# EAGLE design dc_dc_2 (EAGLE 9.6.2)
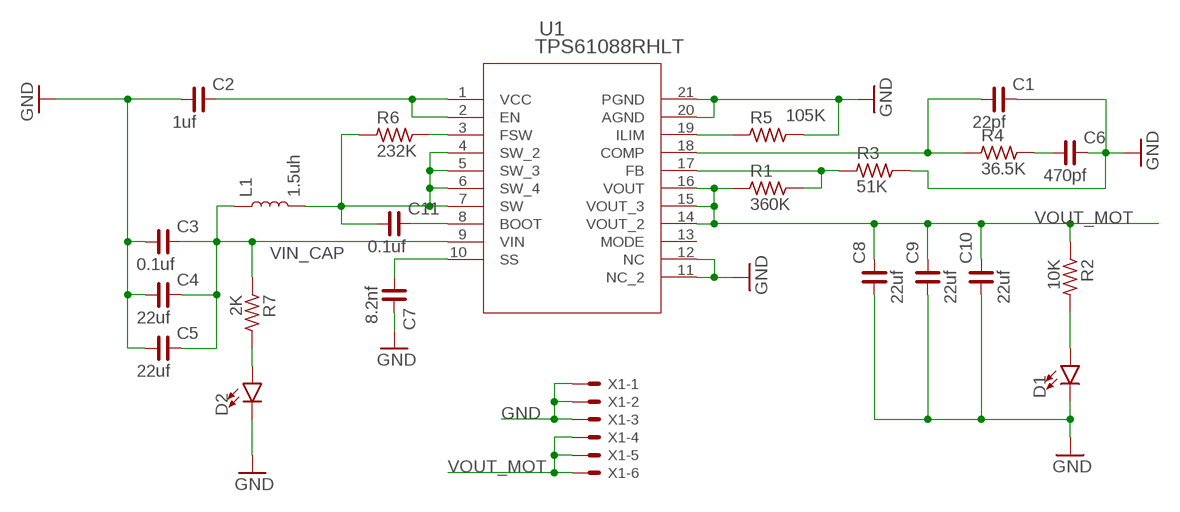
[diagram p0: schematic, sheet 1]

## Parts
C1  22pf  C_0603  [C0603]
C2  1uf  C_0603  [C0603]
C3  0.1uf  C_1210  [C1210]
C4  22uf  C_1210  [C1210]
C5  22uf  C_1210  [C1210]
C6  470pf  C_0603  [C0603]
C7  8.2nf  C_0603  [C0603]
C8  22uf  C_1210  [C1210]
C9  22uf  C_1210  [C1210]
C10  22uf  C_1210  [C1210]
C11  0.1uf  C_0603  [C0603]
D1  LED0603  [LED-0603]
D2  LED0603  [LED-0603]
L1  1.5uh  INDUCTOR-CR75-68UH  [CR75]
R1  360K  R_0603  [R0603]
R2  10K  R_0603  [R0603]
R3  51K  R_0603  [R0603]
R4  36.5K  R_0603  [R0603]
R5  105K  R_0603  [R0603]
R6  232K  R_0603  [R0603]
R7  2K  R_0603  [R0603]
U1  TPS61088RHLT  [RHL0020A_TEX]
X1  22-23-2061  [22-23-2061]

## Nets
GND: C1.2 C2.1 C3.1 C4.1 C5.1 C6.2 C7.2 C8.1 C9.1 C10.1 D1.C D2.C R3.2 R5.2 U1.11(NC_2) U1.12(NC) U1.20(AGND) U1.21(PGND) X1.1 X1.2 X1.3
N$1: C7.1 U1.10(SS)
N$2: R5.1 U1.19(ILIM)
N$3: C1.1 R4.1 U1.18(COMP)
N$4: C6.1 R4.2
N$5: C2.2 U1.1(VCC) U1.2(EN)
N$6: D2.A R7.2
N$8: R1.2 R3.1 U1.17(FB)
N$9: D1.A R2.2
N$10: C11.2 U1.8(BOOT)
N$11: C11.1 L1.P$2 R6.1 U1.4(SW_2) U1.5(SW_3) U1.6(SW_4) U1.7(SW)
N$12: R6.2 U1.3(FSW)
VIN_CAP: C3.2 C4.2 C5.2 L1.P$1 R7.1 U1.9(VIN)
VOUT_MOT: C8.2 C9.2 C10.2 R1.1 R2.1 U1.14(VOUT_2) U1.15(VOUT_3) U1.16(VOUT) X1.4 X1.5 X1.6
Unconnected: U1.13(MODE)

## Library data of the parts
C1-C11 = rc-master-smd:C_: NON-POLARIZED CAP
D1 D2 = SparkFun-LED:LED: LED (Generic) Standard schematic elements and footprints for 5mm, 3mm, 1206, and 0603 sized LEDs. Generic LEDs with no color specified.
L1 = SparkFun-Coils:INDUCTOR: Inductors Resist changes in electrical current. Basically a coil of wire. SparkFun Products: SparkFun Load Cell Amplifier - HX711 <https://www.sparkfun.com/products/13879> IOIO-OTG - V2.2 <https://www.sparkfun.com/products/13613>; PROD_ID: NDUC-09739; VALUE: 68µH/±20%/1.05A
R1-R7 = rc-master-smd:R_: RESISTOR
U1 = TPS61088:TPS61088RHLT: TPS61088; BUILT_BY: EMA_UL_Team; COPYRIGHT: Copyright (C) 2018 Accelerated Designs. All rights reserved; MANUFACTURER_PART_NUMBER: TPS61088RHLT; SOURCELIBRARY: TI_2019-03-28; VENDOR: Texas Instruments
X1 = con-molex:22-23-2061: .100" (2.54mm) Center Header - 6 Pin; MF: MOLEX; MPN: 22-23-2061; OC_FARNELL: 1462922; OC_NEWARK: 27C1933

## Board
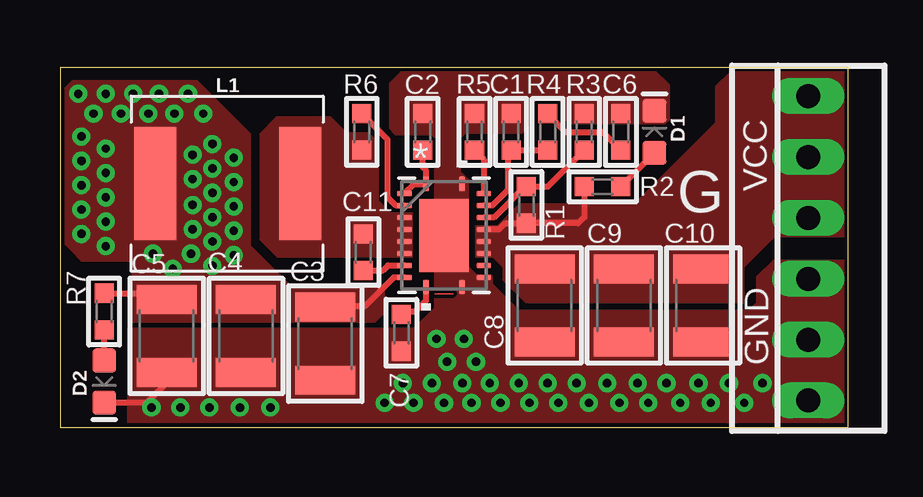
[diagram p1: board, top side]
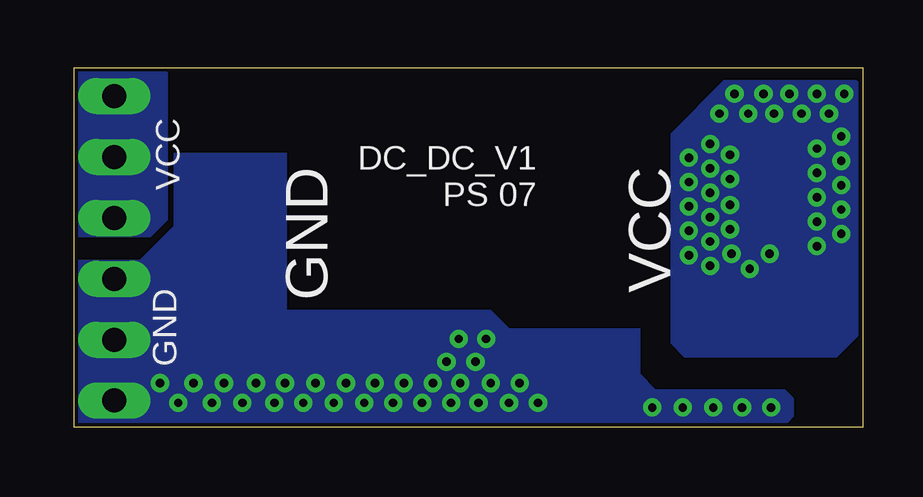
[diagram p2: board, bottom side, seen from below]

Size 32.84 x 15 mm. Coordinates in mm from the lower left corner, seen from the top.
Outline: 0,0 32.84,0 32.84,15 0,15 0,0
Copper layers (1*16): Top 0.035mm / dielectric 1.5mm / Bottom 0.035mm
Design rules "default *": minimum track width 6mil, minimum drill 0.35mm, track to track 6mil, track to pad 6mil, pad to pad 6mil, via to via 6mil, smd to smd 6mil, copper to edge 6mil, drill to drill 6mil, minimum pad ring 10mil, minimum via ring 8mil, stop-mask expansion 4mil, vias tented up to drill 30mil, thermal gap 10mil

### Footprints (pad centres in the part's own frame; a part is rotated, then mirrored left to right if it is on the bottom)
C0603 = smd 0.8 x 0.8: 1 -0.762,0; 2 0.762,0
C1210 = smd 1.2 x 2.5: 1 -1.524,0; 2 1.524,0
LED-0603 = smd 1 x 1: A -0.877,0; C 0.877,0
CR75 = smd 1.75 x 4.7: P$1 -3.025,0; P$2 3.025,0
R0603 = smd 0.8 x 0.8: 1 -0.762,0; 2 0.762,0
RHL0020A_TEX = smd 0.229 x 0.61: 1 -0.75,2.15; 10 -0.75,-2.15; 11 0.75,-2.15; 20 0.75,2.15 | smd 0.61 x 0.229: 2 -1.65,1.75; 3 -1.65,1.25; 4 -1.65,0.75; 5 -1.65,0.25; 6 -1.65,-0.25; 7 -1.65,-0.75; 8 -1.65,-1.25; 9 -1.65,-1.75; 12 1.65,-1.75; 13 1.65,-1.25; 14 1.65,-0.75; 15 1.65,-0.25; 16 1.65,0.25; 17 1.65,0.75; 18 1.65,1.25; 19 1.65,1.75 | smd 2.057 x 3.048: 21 0,0
22-23-2061 = drill 1 long: 1 -6.35,0; 2 -3.81,0; 3 -1.27,0; 4 1.27,0; 5 3.81,0; 6 6.35,0

### Placement (x,y rotation side)
C1  18.8,12.32 90 top
C2  15.11,12.32 270 top
C3  11.05,3.49 90 top
C4  7.75,3.81 90 top
C5  4.45,3.81 90 top
C6  23.37,12.32 90 top
C7  14.22,3.94 270 top
C8  20.19,5.08 90 top
C9  23.5,5.08 90 top
C10  26.8,5.08 90 top
C11  12.64,7.3 270 top
D1  24.77,12.32 90 top
D2  1.84,1.91 270 top
L1  6.99,10.16 0 top
R1  19.43,9.27 90 top
R2  22.61,10.03 0 top
R3  21.84,12.32 90 top
R4  20.32,12.32 90 top
R5  17.27,12.32 90 top
R6  12.57,12.32 90 top
R7  1.84,4.83 270 top
U1  16,8 0 top
X1  31.18,7.46 90 top

### Tracks (layer width: path | path; a pad name or v marks a point on that pad's centre or on a via)
GND  (via drill 0.35)
  Top 0.254: D2.C 3.63,1.03 4.45,1.84 C5.1
  other vias: 3.81,0.83 5.02,0.83 6.22,0.83 7.49,0.83 8.76,0.83 13.53,1.02 14.73,1.02 16,1.02 17.14,1.02 18.35,1.02 19.56,1.02 20.76,1.02 22.03,1.02 23.3,1.02 24.51,1.02 25.84,1.02 27.11,1.02 28.51,1.02 14.29,1.84 15.49,1.84 16.76,1.84 17.91,1.84 19.11,1.84 20.32,1.84 21.53,1.84 22.8,1.84 24.07,1.84 25.27,1.84 26.61,1.84 27.88,1.84 29.27,1.84 16.13,2.73 17.34,2.73 16.83,3.68 15.68,3.68
  pour Top (no thermals): 17.02,9.53 17.02,6.73 17.37,6.38 17.97,6.38 18.03,6.32 18.03,5.97 19.11,4.89 28.7,4.89 28.7,0.19 15.59,0.19 15.59,8.48 16.64,9.53
  pour Top (no thermals): 15.68,5 15.61,5 14.75,4.14 2.81,4.14 2.81,0.19 15.68,0.19
  pour Top (no thermals): 15.59,6.29 15.59,10.76 15.68,10.86 15.68,12 15.49,12.19 13.97,12.19 13.72,12.45 13.72,14.35 14.29,14.92 24.77,14.92 25.4,14.29 25.4,12.83 25.21,12.64 21.21,12.64 20.95,12.89 20.95,13.46 20.76,13.65 19.88,13.65 19.75,13.53 19.75,12.76 19.24,12.26 16.89,12.26 16.7,12.06 16.7,10.67 17.03,10.33 17.03,6.29
  pour Top (no thermals): 28.38,0.19 32.83,0.19 32.83,6.99 29.72,6.99 29.02,6.29 29.02,5.21 28.7,4.89 28.45,4.89 28.45,0.25
  pour Bottom (no thermals): 9.27,4.13 9.27,2.22 8.64,1.59 3.24,1.59 2.86,1.21 2.86,0.44 3.11,0.19 32.7,0.19 32.7,6.99 29.72,6.99 29.02,6.29 29.02,5.21 28.7,4.89 15.49,4.89 14.73,4.13
  pour Bottom (no thermals): 32.77,4.32 28.7,8.38 28.7,11.43 24,11.43 24,1.84 32.77,1.84
N$1
  Top 0.254: C7.1 14.35,4.83 14.8,4.83 15.25,5.28 U1.10
N$2
  Top 0.254: R5.1 17.65,11.18 U1.19
N$3
  Top 0.254: R4.1 C1.1 18.67,11.43 18.67,9.91 18.01,9.25 U1.18
N$4
  Top 0.254: R4.2 21.08,12.32 22.61,12.32 C6.1
N$5
  Top 0.254: U1.2 14.75,10.15 U1.1 15.25,10.72 15.11,10.86 C2.2
N$6
  Top 0.254: D2.A R7.2
N$8
  Top 0.254: R3.1 20.32,10.03 R1.2 19.37,10.03 18.09,8.75 U1.17
N$9
  Top 0.254: R2.2 D1.A
N$10
  Top 0.254: C11.2 13.46,6.54 13.67,6.75 U1.8
N$11
  pour Top (no thermals): 14.7,8.95 14.7,7.08 9.05,7.08 8.32,7.81 8.32,12.26 9.02,12.95 11.27,12.95 11.94,12.29 12.86,12.29 13.27,11.87 13.27,9.46 13.78,8.95
N$12
  Top 0.254: R6.2 13.65,12 13.65,9.59 13.99,9.25 U1.3
VIN_CAP  (via drill 0.35)
  Top 0.254: C3.2 11.05,5.04 12.7,5.04 13.91,6.25 U1.9 | R7.1 4.19,5.59 C5.2
  other vias: 0.76,13.91 1.91,13.91 3.05,13.91 4.13,13.91 5.33,13.91 0.89,12.13 0.89,11.11 0.89,10.1 0.89,9.08 0.89,8.06 1.4,13.08 2.54,13.08 3.68,13.08 4.76,13.08 5.97,13.08 1.91,11.62 1.91,10.6 1.91,9.59 1.91,8.57 1.91,7.56 6.35,11.81 6.35,10.79 6.35,9.78 6.35,8.76 6.35,7.75 7.24,11.24 7.24,10.22 7.24,9.21 7.24,8.19 7.24,7.18 4.7,6.6 3.87,7.24 5.46,7.24 6.35,6.73 5.52,11.37 5.52,10.35 5.52,9.27 5.52,8.26
  pour Top (no thermals): 13.48,5.89 9.64,5.89 7.94,7.59 7.94,12.26 5.71,14.48 2.98,14.48 2.98,4.38 13.14,4.38 13.53,4.76 13.53,5.84
  pour Top (no thermals): 3.11,14.48 0.51,14.48 0.19,14.16 0.19,7.62 0.51,7.3 0.89,6.92 3.11,6.92
  pour Bottom (no thermals): 0.25,14.48 5.78,14.48 8,12.26 8,3.49 7.43,2.92 1.08,2.92 0.19,3.81 0.19,14.41
VOUT_MOT
  Top 0.254: R2.1 21.84,8.76 21.59,8.51 R1.1 18.54,8.51 18.28,8.25 U1.16
  pour Top (no thermals): 17.3,8.41 18.22,8.41 19.15,9.33 28.51,9.33 28.51,5.18 19.4,5.18 18.45,6.13 18.45,6.67 18.03,7.08 17.3,7.08
  pour Top (no thermals): 23.56,8.95 27.3,12.7 27.3,14.22 27.94,14.86 32.77,14.86 32.77,7.94 29.78,7.94 28.51,6.67 25.21,6.67 23.56,8.32
  pour Bottom (no thermals): 32.7,7.94 32.7,14.86 29.02,14.86 28.96,14.8 28.96,8.64 29.65,7.94

### Text on the board
tPlace: VCC | G | GND
bPlace: VCC | DC_DC_V1 / PS 07 | VCC | GND | GND